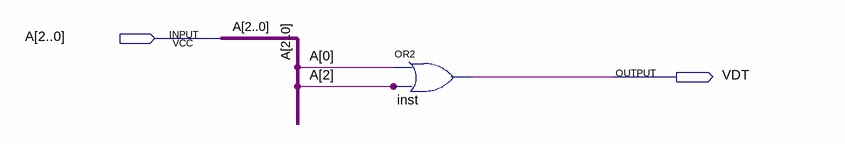
[diagram p0: schematic sheet]
// Quartus schematic assignment4a.bdf as structural Verilog: 1 symbols, 2 pins
module assignment4a (
  input  [2:0] A,
  output VDT
);

  or inst (VDT, A[0], A[2]);
endmodule
